# Altium schematic sheet HallEffectSupport.SchDoc
size A4
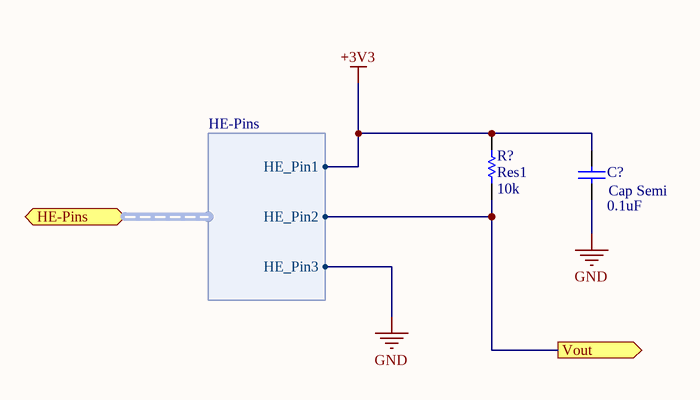
[diagram p0: HallEffectSupport.SchDoc]

## Parts
C?  Cap Semi  value 0.1uF  [C1206]
R?  Res1  value 10k  [AXIAL-0.3]

## Ports
HE-Pins (harness HE-Pins), Vout (out)

## Harnesses
HE-Pins: HE_Pin1, HE_Pin2, HE_Pin3

## Nets
+3V3: C?.2 R?.2 ; port HE-Pins.HE_Pin1
GND: C?.1 ; port HE-Pins.HE_Pin3
Vout: R?.1 ; port Vout, port HE-Pins.HE_Pin2

## Library data of the parts
C? = Cap Semi: Capacitor (Semiconductor SIM Model); Published: 8-Jun-2000; LatestRevisionDate: 29-May-2009; LatestRevisionNote: IPC-7351 Footprint Added.; PackageReference: C1206; Publisher: Altium Limited; PackageDescription: Chip Capacitor
R? = Res1: Resistor; Published: 8-Jun-2000; LatestRevisionDate: 17-Jul-2002; LatestRevisionNote: Re-released for DXP Platform.; PackageReference: AXIAL-0.3; Publisher: Altium Limited; PackageDescription: Axial Device, Thru-Hole; 2 Leads; 0.3 in Pin Spacing